# EAGLE board rpusb (EAGLE 9.6.2)
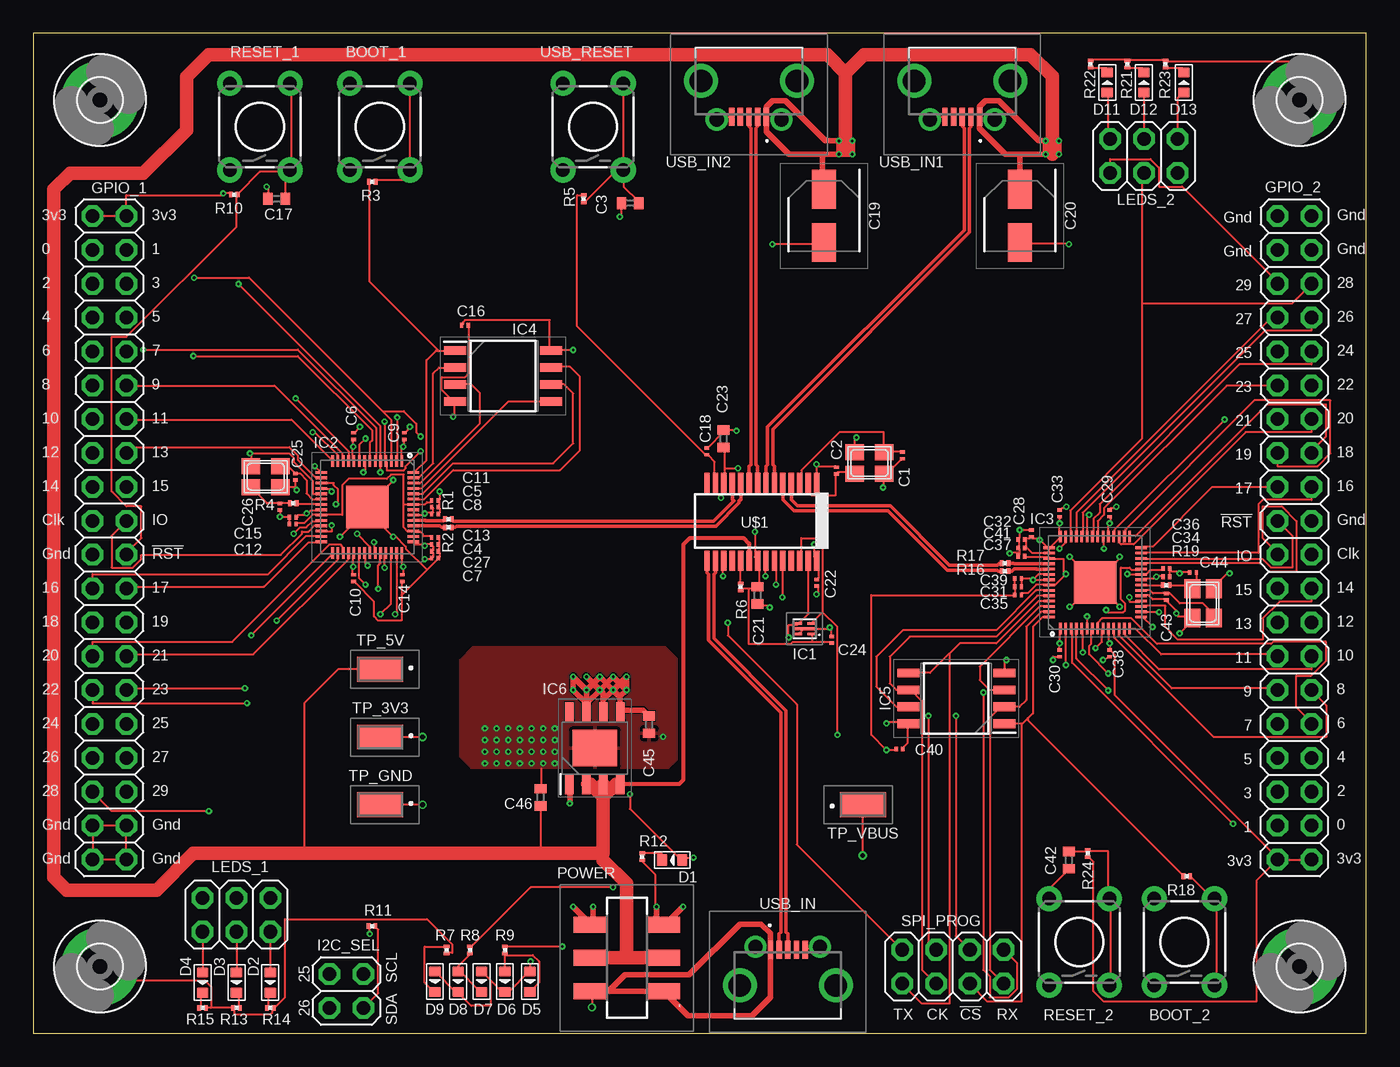
[diagram p4: board, top side]
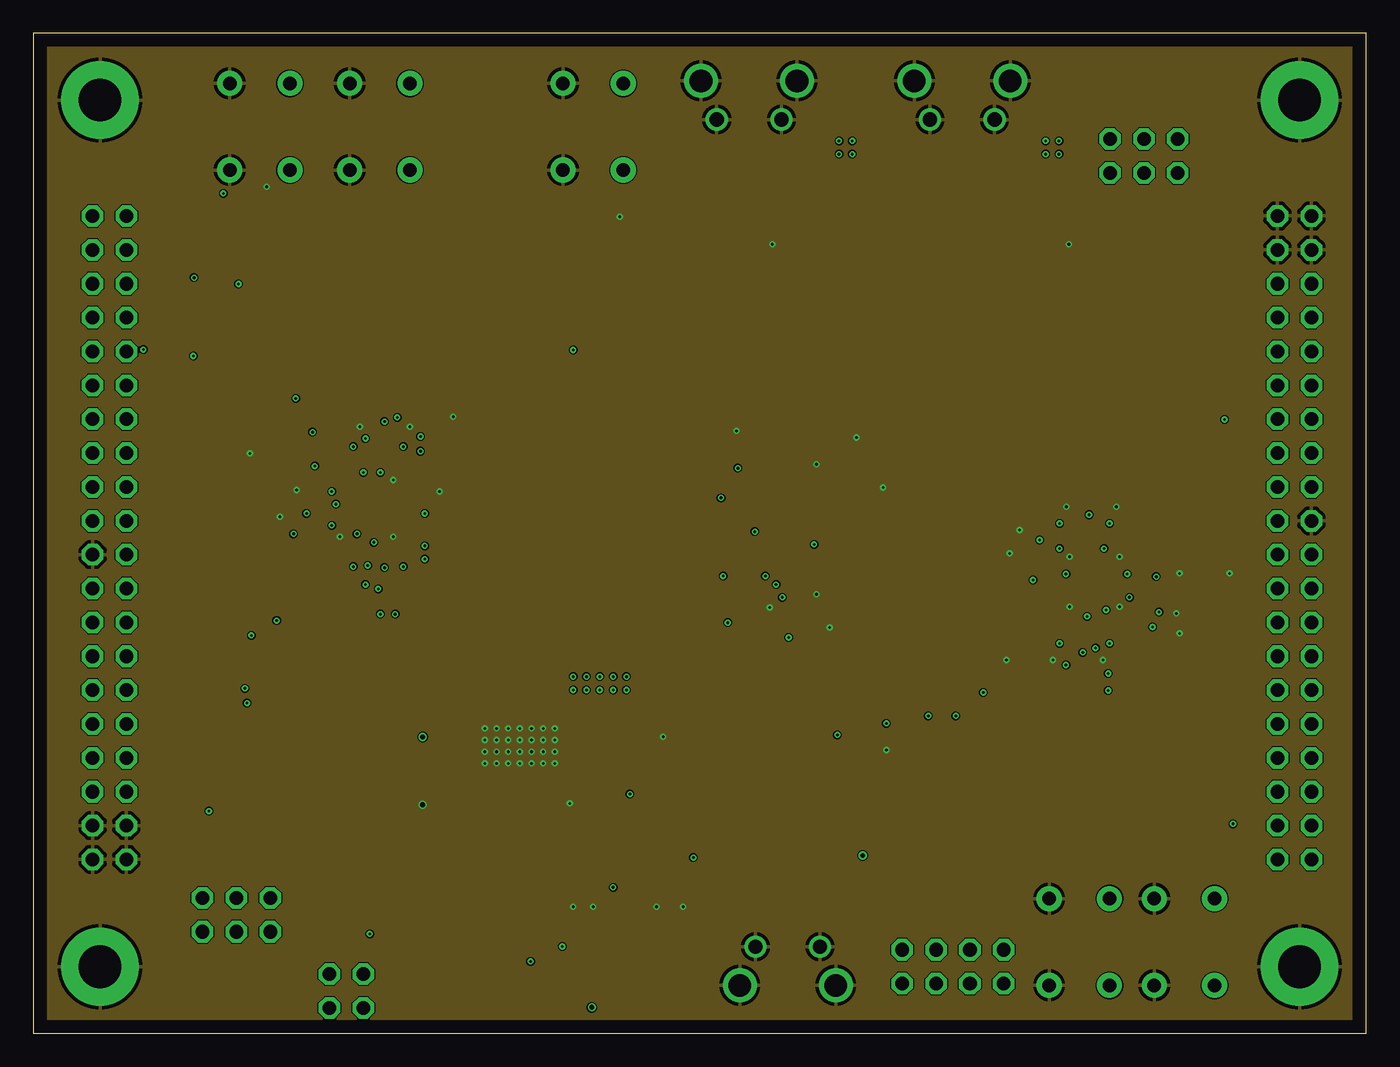
[diagram p5: board, inner layer Route2]
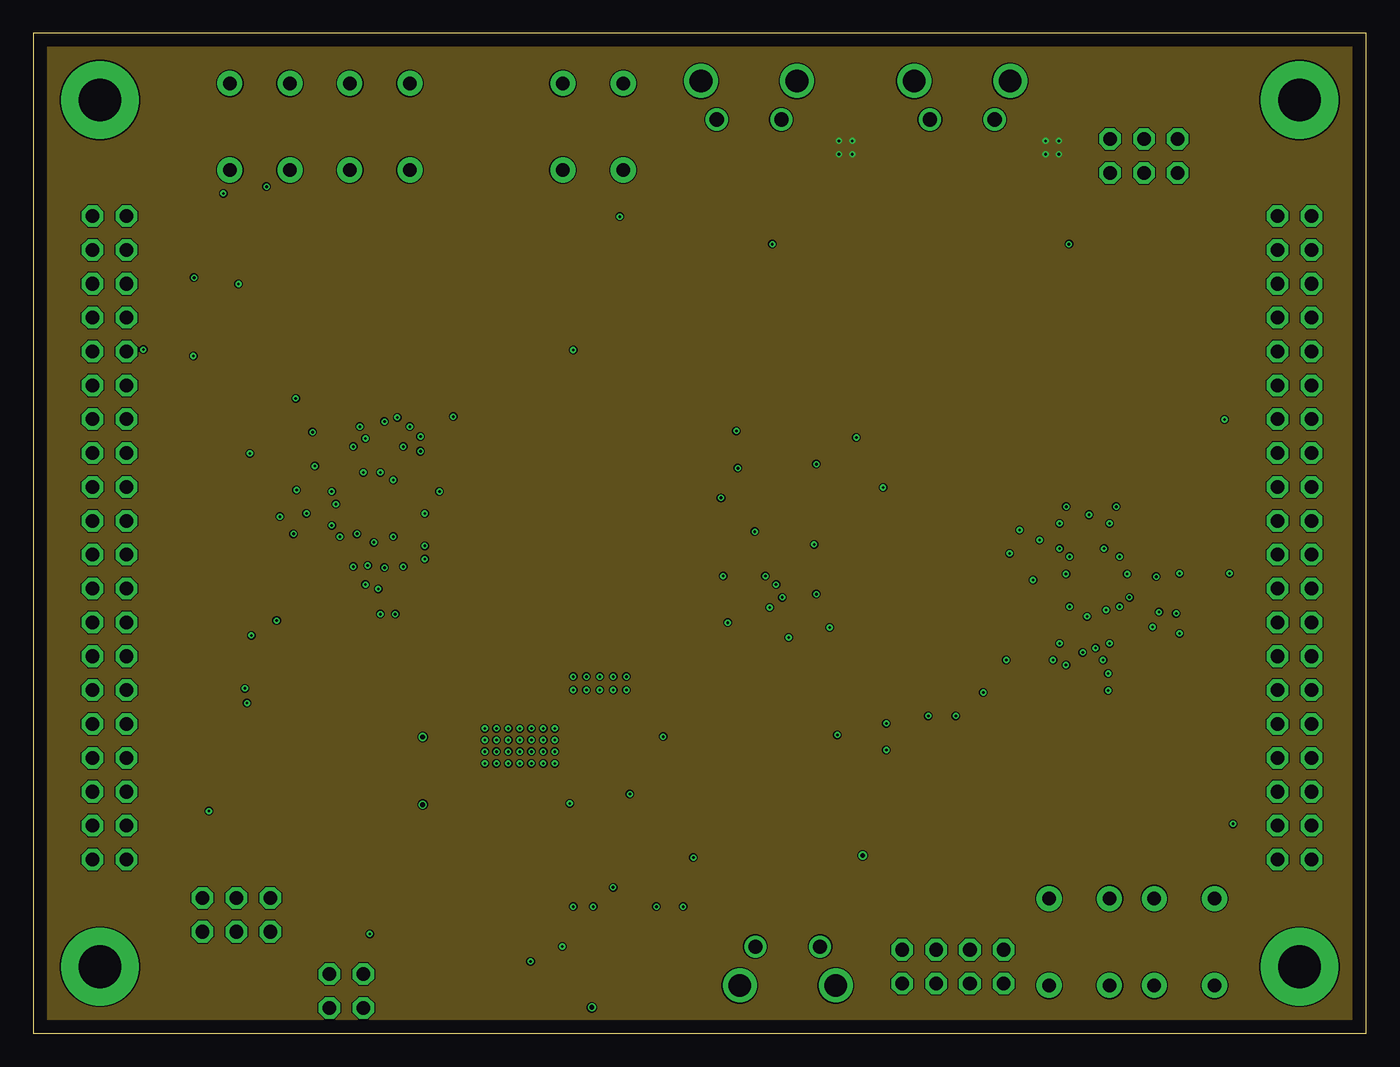
[diagram p6: board, inner layer Route15]
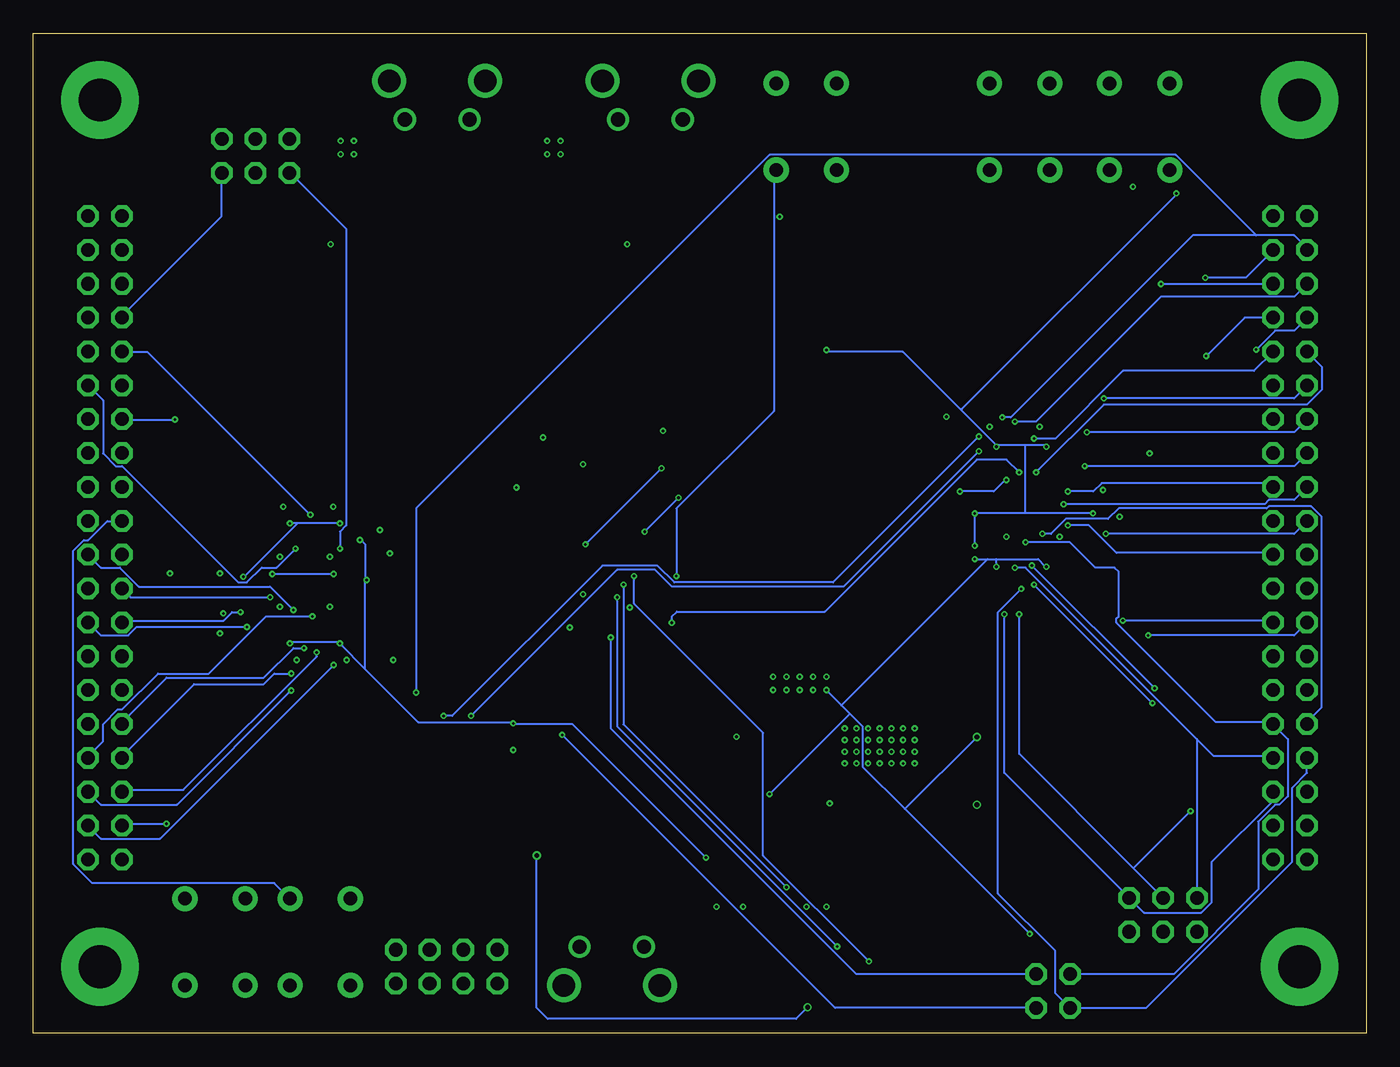
[diagram p7: board, bottom side, seen from below]

Size 100 x 75 mm. Coordinates in mm from the lower left corner, seen from the top.
Outline: 0,0 100,0 100,75 0,75 0,0
Copper layers (1+2*15+16): Top 0.0175mm / dielectric 0.195mm / Route2 0.0175mm / dielectric 1.065mm / Route15 0.0175mm / dielectric 0.195mm / Bottom 0.0175mm
Design rules "default *": minimum track width 3.5mil, minimum drill 0.2mm, track to track 3.5mil, track to pad 3.5mil, pad to pad 5mil, via to via 0.5mm, smd to smd 3.5mil, copper to edge 40mil, drill to drill 0.5mm, minimum pad ring 0.3mm, minimum via ring 0.13mm, stop-mask expansion 4mil, vias tented up to drill 0mil, thermal gap 10mil
Net classes: 0 default: width 0.152 mm; 1 USB: width 0.254 mm, clearance 0.127 mm to class 0, clearance 0.127 mm

## Footprints (pad centres in the part's own frame; a part is rotated, then mirrored left to right if it is on the bottom)
TACTILE-PTH = drill 1.016 pad 1.88: 1 -3.251,2.261; 2 3.251,2.261; 3 -3.251,-2.261; 4 3.251,-2.261
C0201 = smd 0.25 x 0.35: 1 -0.25,0; 2 0.25,0
C0402 = smd 0.7 x 0.9: 1 -0.65,0; 2 0.65,0
CAPAE530X550N = smd 2.9 x 1.8: 1 -2,0; 2 2,0
LED-0603 = smd 0.762 x 0.889: + -0.762,0; - 0.762,0
2X20 = drill 1.016 octagon: 1 -24.13,-1.27; 2 -24.13,1.27; 3 -21.59,-1.27; 4 -21.59,1.27; 5 -19.05,-1.27; 6 -19.05,1.27; 7 -16.51,-1.27; 8 -16.51,1.27; 9 -13.97,-1.27; 10 -13.97,1.27; 11 -11.43,-1.27; 12 -11.43,1.27; 13 -8.89,-1.27; 14 -8.89,1.27; 15 -6.35,-1.27; 16 -6.35,1.27; 17 -3.81,-1.27; 18 -3.81,1.27; 19 -1.27,-1.27; 20 -1.27,1.27; 21 1.27,-1.27; 22 1.27,1.27; 23 3.81,-1.27; 24 3.81,1.27; 25 6.35,-1.27; 26 6.35,1.27; 27 8.89,-1.27; 28 8.89,1.27; 29 11.43,-1.27; 30 11.43,1.27; 31 13.97,-1.27; 32 13.97,1.27; 33 16.51,-1.27; 34 16.51,1.27; 35 19.05,-1.27; 36 19.05,1.27; 37 21.59,-1.27; 38 21.59,1.27; 39 24.13,-1.27; 40 24.13,1.27
3,2-PAD = drill 3.2 pad 5.842: B3,2 0,0
2X02 = drill 1.016 octagon: 1 -1.27,-1.27; 2 -1.27,1.27; 3 1.27,-1.27; 4 1.27,1.27
M24C32FMH6TG = smd 0.6 x 0.2: 1 -0.5,0.4; 3 -0.5,-0.4; 4 0.5,-0.4; 5 0.5,0.4 | smd 1.6 x 0.2: 2 0,0
QFN40P700X700X90-57N = smd 0.85 x 0.2: 1 -3.45,2.6; 2 -3.45,2.2; 3 -3.45,1.8; 4 -3.45,1.4; 5 -3.45,1; 6 -3.45,0.6; 7 -3.45,0.2; 8 -3.45,-0.2; 9 -3.45,-0.6; 10 -3.45,-1; 11 -3.45,-1.4; 12 -3.45,-1.8; 13 -3.45,-2.2; 14 -3.45,-2.6; 29 3.45,-2.6; 30 3.45,-2.2; 31 3.45,-1.8; 32 3.45,-1.4; 33 3.45,-1; 34 3.45,-0.6; 35 3.45,-0.2; 36 3.45,0.2; 37 3.45,0.6; 38 3.45,1; 39 3.45,1.4; 40 3.45,1.8; 41 3.45,2.2; 42 3.45,2.6 | smd 0.2 x 0.85: 15 -2.6,-3.45; 16 -2.2,-3.45; 17 -1.8,-3.45; 18 -1.4,-3.45; 19 -1,-3.45; 20 -0.6,-3.45; 21 -0.2,-3.45; 22 0.2,-3.45; 23 0.6,-3.45; 24 1,-3.45; 25 1.4,-3.45; 26 1.8,-3.45; 27 2.2,-3.45; 28 2.6,-3.45; 43 2.6,3.45; 44 2.2,3.45; 45 1.8,3.45; 46 1.4,3.45; 47 1,3.45; 48 0.6,3.45; 49 0.2,3.45; 50 -0.2,3.45; 51 -0.6,3.45; 52 -1,3.45; 53 -1.4,3.45; 54 -1.8,3.45; 55 -2.2,3.45; 56 -2.6,3.45 | smd 3.2 x 3.2: 57 0,0
SOIC127P790X216-8N = smd 1.65 x 0.65: 1 -3.6,1.905; 2 -3.6,0.635; 3 -3.6,-0.635; 4 -3.6,-1.905; 5 3.6,-1.905; 6 3.6,-0.635; 7 3.6,0.635; 8 3.6,1.905
SOIC127P600X163-9N = smd 1.5 x 0.65: 1 -2.7,1.905; 2 -2.7,0.635; 3 -2.7,-0.635; 4 -2.7,-1.905; 5 2.7,-1.905; 6 2.7,-0.635; 7 2.7,0.635; 8 2.7,1.905 | smd 2.71 x 3.35: 9 0,0
2X03 = drill 1.016 octagon: 1 -2.54,-1.27; 2 -2.54,1.27; 3 0,-1.27; 4 0,1.27; 5 2.54,-1.27; 6 2.54,1.27
JS202011SCQN = smd 1.2 x 2.5: 1 -2.5,-2.75; 2 0,-2.75; 3 2.5,-2.75; 4 2.5,2.75; 5 0,2.75; 6 -2.5,2.75
NX3225 = smd 1.4 x 1.2: 1 -1.1,-0.8; 2 1.1,-0.8; 3 1.1,0.8; 4 -1.1,0.8
R0201 = smd 0.28 x 0.43: 1 -0.255,0; 2 0.255,0
2X04 = drill 1.016 octagon: 1 -3.81,-1.27; 2 -3.81,1.27; 3 -1.27,-1.27; 4 -1.27,1.27; 5 1.27,-1.27; 6 1.27,1.27; 7 3.81,-1.27; 8 3.81,1.27
S175146R = smd 3.45 x 1.85: 1 0,0
SSOP28-0.635 = smd 0.4 x 1.5: 1 -4.108,-2.844; 2 -3.476,-2.844; 3 -2.844,-2.844; 4 -2.212,-2.844; 5 -1.58,-2.844; 6 -0.948,-2.844; 7 -0.316,-2.844; 8 0.316,-2.844; 9 0.948,-2.844; 10 1.58,-2.844; 11 2.212,-2.844; 12 2.844,-2.844; 13 3.476,-2.844; 14 4.108,-2.844; 15 4.108,2.976; 16 3.476,2.976; 17 2.844,2.976; 18 2.212,2.976; 19 1.58,2.976; 20 0.948,2.976; 21 0.316,2.976; 22 -0.316,2.976; 23 -0.948,2.976; 24 -1.58,2.976; 25 -2.212,2.976; 26 -2.844,2.976; 27 -3.476,2.976; 28 -4.108,2.976
U254051T4BHJ25S2S = smd 0.4 x 1.35: 1 -1.3,0.675; 2 -0.65,0.675; 3 0,0.675; 4 0.65,0.675; 5 1.3,0.675 | drill 1.7 pad 2.3: MH1 -3.6,-2; MH2 3.6,-2 | drill 1.07 pad 1.4: MH3 2.425,0.9; MH4 -2.425,0.9

## Placement (x,y rotation side)
BOOT_1  B3F-1005  [TACTILE-PTH]  26,68 90 top
BOOT_2  B3F-1005  [TACTILE-PTH]  86.36,6.85 90 top
C1  15pF  [C0201]  65.21,43.35 270 top
C2  15pF  [C0201]  60.26,42.2 90 top
C3  10uF  [C0402]  44.78,62.27 180 top
C4  100nF  [C0201]  30.13,36.67 0 top
C5  100nF  [C0201]  30.13,39.46 0 top
C6  100nF  [C0201]  24.03,44.79 90 top
C7  100nF  [C0201]  30.13,35.65 0 top
C8  100nF  [C0201]  30.13,38.96 0 top
C9  100nF  [C0201]  27.84,44.79 90 top
C10  100nF  [C0201]  24.03,34.14 270 top
C11  100nF  [C0201]  30.13,39.97 0 top
C12  100nF  [C0201]  19.47,38.2 180 top
C13  1uF  [C0201]  30.13,37.18 0 top
C14  100nF  [C0201]  27.69,34.14 270 top
C15  100nF  [C0201]  19.47,38.71 180 top
C16  100nF  [C0201]  32.39,53.11 0 top
C17  10uF  [C0402]  18.26,62.59 180 top
C18  100nF  [C0201]  50.53,43.64 90 top
C19  100uF  [CAPAE530X550N]  59.32,61.31 270 top
C20  100uF  [CAPAE530X550N]  74.02,61.31 270 top
C21  4.7uF  [C0402]  54.34,32.84 270 top
C22  100nF  [C0201]  58.78,33.8 270 top
C23  4.7uF  [C0402]  51.8,44.59 90 top
C24  100nF  [C0201]  59.9,29.52 90 top
C25  15pF  [C0201]  19.65,41.75 270 top
C26  15pF  [C0201]  18.5,39.5 270 top
C27  1uF  [C0201]  30.13,36.16 0 top
C28  100nF  [C0201]  74.88,37.5 90 top
C29  100nF  [C0201]  80.75,39 90 top
C30  100nF  [C0201]  77,28.5 270 top
C31  100nF  [C0201]  73.88,33.5 180 top
C32  100nF  [C0201]  74.12,37.03 180 top
C33  100nF  [C0201]  77,39 90 top
C34  100nF  [C0201]  85,34.25 0 top
C35  100nF  [C0201]  73.88,32.88 180 top
C36  100nF  [C0201]  85,34.88 0 top
C37  1uF  [C0201]  74.12,35.78 180 top
C38  100nF  [C0201]  80.75,28.5 270 top
C39  100nF  [C0201]  73.88,34.12 180 top
C40  100nF  [C0201]  64.98,21.31 180 top
C41  1uF  [C0201]  74.12,36.4 180 top
C42  10uF  [C0402]  77.68,12.99 270 top
C43  15pF  [C0201]  85,32.75 270 top
C44  15pF  [C0201]  87.01,34.57 180 top
C45  10uF  [C0402]  46.2,23.16 270 top
C46  10uF  [C0402]  38.04,17.69 90 top
D1  GREEN  [LED-0603]  47.93,13 180 top
D2  GREEN  [LED-0603]  17.78,3.81 270 top
D3  GREEN  [LED-0603]  15.24,3.81 270 top
D4  GREEN  [LED-0603]  12.7,3.81 270 top
D5  GREEN  [LED-0603]  37.25,3.88 270 top
D6  GREEN  [LED-0603]  35.38,3.88 270 top
D7  GREEN  [LED-0603]  33.62,3.88 270 top
D8  GREEN  [LED-0603]  31.88,3.88 270 top
D9  GREEN  [LED-0603]  30.12,3.88 270 top
D11  GREEN  [LED-0603]  80.57,71.31 90 top
D12  GREEN  [LED-0603]  83.32,71.31 90 top
D13  GREEN  [LED-0603]  86.32,71.31 90 top
GPIO_1  [2X20]  5.71,37.17 270 top
GPIO_2  [2X20]  94.61,37.17 90 top
H1  MOUNT-PAD-ROUND3.2  [3,2-PAD]  95,5 0 top
H2  MOUNT-PAD-ROUND3.2  [3,2-PAD]  95,70 0 top
H3  MOUNT-PAD-ROUND3.2  [3,2-PAD]  5,70 0 top
H4  MOUNT-PAD-ROUND3.2  [3,2-PAD]  5,5 0 top
I2C_SEL  [2X02]  23.5,3.17 270 top
IC1  M24C02-FMH6TG  [M24C32FMH6TG]  57.87,30.34 180 top
IC2  RP2040  [QFN40P700X700X90-57N]  25.05,39.46 270 top
IC3  RP2040  [QFN40P700X700X90-57N]  79.65,33.82 90 top
IC4  16MB_Flash  [SOIC127P790X216-8N]  35.24,49.3 0 top
IC5  16MB_Flash  [SOIC127P790X216-8N]  69.24,25.12 180 top
IC6  AP7362-33SP-13  [SOIC127P600X163-9N]  42.12,21.4 90 top
LEDS_1  [2X03]  15.24,8.89 180 top
LEDS_2  [2X03]  83.32,65.81 0 top
POWER  JS202011SCQN  [JS202011SCQN]  44.53,5.66 90 top
Q1  12MHz  [NX3225]  17.43,41.75 180 top
Q2  12MHz  [NX3225]  62.73,42.78 180 top
Q3  12MHz  [NX3225]  87.75,32.25 90 top
R1  27R4  [R0201]  31.15,38.58 0 top
R2  27R4  [R0201]  31.15,37.94 0 top
R3  1K  [R0201]  25.43,63.86 180 top
R4  1K  [R0201]  19.5,39.75 0 top
R5  10K  [R0201]  41.29,62.59 90 top
R6  10K  [R0201]  53.07,33.48 270 top
R7  330R  [R0201]  31,6.25 90 top
R8  330R  [R0201]  32.75,6.25 90 top
R9  330R  [R0201]  35.38,6.25 90 top
R10  10K  [R0201]  15.08,62.91 180 top
R11  1K5  [R0201]  25.41,8.05 0 top
R12  1K  [R0201]  45.68,13.25 270 top
R13  1K  [R0201]  15.24,1.91 180 top
R14  1K  [R0201]  17.78,1.91 0 top
R15  1K  [R0201]  12.7,1.91 0 top
R16  27R4  [R0201]  72.9,34.67 180 top
R17  27R4  [R0201]  72.9,35.26 180 top
R18  1K  [R0201]  86.53,11.78 180 top
R19  1K  [R0201]  85,33.62 180 top
R21  1K  [R0201]  82.07,72.69 90 top
R22  1K  [R0201]  79.32,72.69 90 top
R23  1K  [R0201]  84.95,72.69 90 top
R24  10K  [R0201]  79.1,13.49 270 top
RESET_1  B3F-1005  [TACTILE-PTH]  17,68 90 top
RESET_2  B3F-1005  [TACTILE-PTH]  78.47,6.85 90 top
SPI_PROG  [2X04]  69,5 180 top
TP_3V3  S1751-46R  [S175146R]  26.04,22.23 0 top
TP_5V  S1751-46R  [S175146R]  26.04,27.3 0 top
TP_GND  S1751-46R  [S175146R]  26.04,17.14 0 top
TP_VBUS  S1751-46R  [S175146R]  62.23,17.14 180 top
U$1  SL2.2S  [SSOP28-0.635]  54.66,38.43 180 top
USB_IN  U254-051T-4BHJ25-S2S  [U254051T4BHJ25S2S]  56.6,5.6 0 top
USB_IN1  U254-051T-4BHJ25-S2S  [U254051T4BHJ25S2S]  69.7,69.44 180 top
USB_IN2  U254-051T-4BHJ25-S2S  [U254051T4BHJ25S2S]  53.7,69.44 180 top
USB_RESET  B3F-1005  [TACTILE-PTH]  42,68 90 top

## Tracks (layer width: path | path; a pad name or v marks a point on that pad's centre or on a via)
!QSPI2_SS!
  Top 0.152: IC3.56 75.72,31.22 75,30.5 75,24 74.63,23.63 | 74.14,23.22 74.22,23.22 74.63,23.63 | 74.14,23.22 73.88,23.22 IC5.1 | R18.2 86.2,11.91 74.61,23.5 74.61,23.65 74.63,23.63 | 74.14,23.22 74.14,2.38 71.6,2.38 70.33,3.65 SPI_PROG.4
!QSPI_SS!
  Top 0.152: IC2.56 28.56,42.06 29.5,43 29.5,50.5 30.2,51.2 30.32,51.2 | 30.32,51.2 IC4.1 | R3.2 25.24,63.82 25.24,56.36 30.32,51.28 30.32,51.2
!RESET_RP1!  (via drill 0.2)
  Top 0.152: 18.89,64.61 19.21,64.61 RESET_1.3 | 18.89,64.61 16.99,64.61 15.4,63.02 R10.1 15.24,62.87 15.24,60.48 6.99,52.23 5.87,52.23 5.87,40.64 6.99,39.53 8.1,39.53 8.1,37.15 6.99,36.04 GPIO_1.22 | 18.89,64.61 18.89,62.71 C17.1 | 18.89,64.61 RESET_1.3 | RESET_1.4 19.37,71.12 19.37,64.77 RESET_1.3 | v22.38,38.1 22.38,37.62 21.75,37.62 IC2.26
  Bottom 0.152: v22.38,38.1 20.8,38.1 18.73,36.04 6.99,36.04 GPIO_1.22
!RESET_RP2!
  Top 0.152: IC3.26 83.19,35.56 92.23,35.56 92.87,34.92 94.46,34.92 94.46,37.31 93.34,38.42 GPIO_2.22 | C42.1 77.79,13.65 79.06,13.65 R24.1 79.22,13.65 80.64,13.65 80.64,10.16 RESET_2.4 80.8,10 80.8,3.65 RESET_2.3
  Bottom 0.152: GPIO_2.22 93.34,38.42 94.46,38.42 95.89,36.99 96.2,36.99 97,36.2 97,12.7 95.57,11.27 81.92,11.27 80.8,10.16 RESET_2.4
!RESET_USB!  (via drill 0.2)
  Top 0.152: R5.1 41.43,62.39 43.66,64.61 44.13,64.61 USB_RESET.3 | C3.1 45.4,62.39 44.29,63.5 44.29,64.61 USB_RESET.3 | v51.75,34.29 51.75,35.4 U$1.17 | USB_RESET.4 44.29,71.12 44.29,64.77 USB_RESET.3
  Bottom 0.152: v51.75,34.29 51.75,39.37 44.45,46.67 44.45,64.45 44.29,64.61 USB_RESET.3
+1V8  (via drill 0.2)
  Top 0.152: C22.1 58.9,34.13 58.9,35.4 U$1.28 58.74,35.56 58.58,35.72 v58.58,36.67 | 51.91,42.39 51.91,41.43 U$1.12 | 51.91,42.39 51.91,43.81 C23.1 | 51.91,42.39 v52.86,42.39
  Bottom 0.152: v52.86,42.39 v58.58,36.67
+1V8_1
  Top 0.152: C12.1 19.84,38.26 20.32,38.26 20.95,38.89 21.59,38.89 IC2.23 21.75,38.89 23.18,38.89 23.18,41.12 23.65,41.59 26.51,41.59 26.83,41.91 27.78,41.91 27.78,39.69 | C11.1 29.84,39.85 29.53,39.85 29.37,39.69 28.57,39.69 IC2.50 28.42,39.69 27.78,39.69 | C13.1 29.84,37.31 29.21,37.31 29.21,37.47 29.05,37.62 28.57,37.62 IC2.45 28.42,37.62 28.1,37.62 27.78,37.94 27.78,39.69
+1V8_2  (via drill 0.2)
  Top 0.152: C37.1 74.45,35.72 76.2,35.72 IC3.45 76.2,35.56 77.31,35.56 77.31,34.29 | C36.1 84.77,34.77 83.82,34.77 83.5,34.45 83.19,34.45 IC3.23 83.03,34.45 v82.07,34.45 | 76.2,33.66 75.25,33.66 74.61,33.02 74.14,33.02 C35.1 | 77.31,34.29 76.68,33.66 76.2,33.66 | 76.2,33.66 IC3.50 | 77.31,34.29 v77.47,34.45
  Bottom 0.152: v77.47,34.45 v82.07,34.45
+3V3  (via drill 0.2)
  Top 0.152: 58.42,29.37 59.85,29.37 C24.1 | 58.42,29.37 58.42,29.84 IC1.1 | 53.66,33.34 54.29,33.34 C21.1 54.45,33.5 54.45,35.4 U$1.21 54.29,35.56 54.13,35.72 v54.13,37.62 | 53.66,33.34 53.18,33.34 R6.2 | 58.42,29.37 56.99,29.37 56.83,29.21 53.66,29.21 53.66,33.34 | R5.2 41.27,62.87 40.8,62.87 40.8,53.02 50.48,43.34 C18.1 50.64,43.34 51.12,42.86 51.12,41.43 U$1.13 51.28,41.27 51.28,40.48 v51.59,40.16
  Bottom 0.152: v51.59,40.16 v54.13,37.62
+3V3_RP  (via drill 0.2, 0.35)
  Top 0.152: 93.34,13.02 91.76,11.43 91.76,2.38 80.33,2.38 79.53,3.17 79.53,12.86 79.22,13.18 R24.2 | 93.34,13.02 95.89,13.02 GPIO_2.1 | 93.34,13.02 GPIO_2.2 93.34,13.18 81.12,25.4 81.12,28.42 80.8,28.73 | v75,34 74.93,34.13 74.14,34.13 C39.1 74.14,33.97 74.14,33.66 C31.1 | v75,34 75.09,33.97 76.2,33.97 IC3.49 IC3.48 75.42,34.42 v75,34 | C34.1 84.77,34.29 84.3,34.29 v84.25,34.25 84.14,34.13 83.19,34.13 83.19,33.97 IC3.22 | C29.1 80.8,38.73 80.8,38.26 v80.75,38.25 80.64,38.1 80.64,37.31 IC3.33 | C33.1 76.99,38.73 v76.99,38.26 v77,38.25 76.99,38.1 76.99,37.31 IC3.42 76.99,37.15 76.2,36.35 | 74.45,36.51 74.45,36.99 C32.1 74.45,37.15 74.77,37.15 C28.1 74.93,37.15 75.41,37.15 v75.5,37 75.56,36.99 76.2,36.35 | 74.45,36.51 C41.1 | 76.2,36.35 IC3.44 74.95,36.02 74.45,36.51 | 76.2,36.35 IC3.43 | v64,23.25 64.14,23.34 65.56,23.34 IC5.8 65.56,23.18 65.56,21.75 65.25,21.43 C40.1 | C30.1 76.99,28.73 76.99,29.21 v77,29.25 76.99,29.37 76.99,30.32 IC3.1 | 80.8,28.73 80.8,29.21 v80.75,29.25 80.64,29.37 80.64,30.32 IC3.10 | 80.8,28.73 C38.1 | v25.24,7.46 25.24,7.94 R11.1 | v44.77,17.94 44.77,16.83 48.58,13.02 D1.+ 48.74,13.02 48.74,13.18 v49.53,13.18 | R10.2 14.76,63.02 14.29,63.02 v14.25,63 14.13,62.87 6.99,62.87 GPIO_1.2 6.99,61.28 4.45,61.28 GPIO_1.1 | v40.5,51.25 40.48,51.28 38.89,51.28 IC4.8 38.73,51.28 38.73,53.5 32.38,53.5 32.23,53.34 32.23,53.18 C16.1 | C6.1 23.97,44.45 23.97,44.13 v24,44 23.97,43.97 23.97,43.02 IC2.10 | C9.1 27.78,44.45 27.78,44.13 v27.75,44 27.62,43.97 27.62,43.02 IC2.1 | C15.1 19.84,38.73 19.84,38.89 20.48,38.89 v20.5,39 20.64,39.05 20.8,39.21 21.59,39.21 IC2.22
  Top 0.152: C5.1 30,39.37 30,39.05 C8.1 29.84,39.05 29.37,39.05 v29.37,38.99 29.21,38.89 28.57,38.89 | 28.57,38.89 28.57,39.21 IC2.49 | 28.57,38.89 IC2.48 | C14.1 27.78,34.45 27.78,34.92 v27.75,35 27.62,35.08 27.62,35.88 IC2.42 | C10.1 23.97,34.45 23.97,34.92 v24,35 23.97,35.08 23.97,35.88 IC2.33 | v29.36,35.56 v29.37,35.56 29.84,35.56 C7.1 30,35.72 30,36.04 C27.1 30,36.2 30,36.51 C4.1 29.84,36.67 29.37,36.67 v29.36,36.56 29.21,36.67 28.57,36.67 28.57,36.83 | 28.57,36.83 28.57,37.31 IC2.44 | 28.57,36.83 IC2.43 | v29.21,22.23 TP_3V3.1
  Top 0.406: 41.49,24.76 IC6.7 41.49,24.74 v42.5,25.75 | 41.49,24.76 v41.49,25.74 v41.5,25.75 | 41.49,24.76 v40.5,25.75 v40.5,26.75 v41.5,25.75 | v42.5,25.75 42.76,25.49 IC6.6 42.76,25.01 v43.5,25.75 | 44.03,24.25 44.03,25.22 | 44.03,25.22 v43.5,25.75 | IC6.5 44.03,24.25 | 44.03,25.22 44.03,25.28 v44.5,25.75 | v43.5,25.75 v42.5,26.75 v41.5,25.75 | v42.5,25.75 v43.5,26.75 v44.5,25.75 | v43.5,25.75 v44.5,26.75 v44.5,25.75 | v42.5,25.75 v41.5,26.75 | C45.1 45.76,24.25 44.03,24.25
  Bottom 0.152: 80.17,38.26 77.15,38.26 v77,38.25 | 80.17,38.26 80.64,38.26 v80.75,38.25 | 80.17,38.26 84.14,34.29 v84.25,34.25 | v75.5,37 75.41,36.99 75.09,36.67 75.09,34.13 v75,34 75.09,33.97 75.09,27.3 | v80.75,29.25 80.64,29.37 77.15,29.37 v77,29.25 76.99,29.21 75.09,27.3 | 75.09,27.3 71.12,23.34 64.14,23.34 v64,23.25 63.98,23.18 59.53,23.18 v49.53,13.18 | 34.61,16.83 37.78,20 37.78,23.02 38.73,23.97 | 34.61,16.83 v25.24,7.46 | 39.37,24.61 40.48,25.72 v40.5,25.75 | 39.37,24.61 38.73,23.97 | 38.73,23.97 v44.77,17.94 | 25.56,44.13 27.62,44.13 v27.75,44 27.78,44.13 30.48,46.83 | 25.56,44.13 24.13,44.13 v24,44 | 28.42,35.56 29.21,35.56 v29.36,35.56 | 28.42,35.56 27.78,35.56 | 27.78,35.56 24.61,35.56 24.13,35.08 v24,35 | 27.78,35.56 27.78,35.08 v27.75,35 | v29.36,36.56 29.37,36.67 29.37,38.89 v29.37,38.99 29.21,39.05 25.56,39.05 | 25.56,39.05 20.64,39.05 v20.5,39 | 25.56,39.05 25.56,44.13 | 30.48,46.83 34.77,51.12 40.48,51.12 v40.5,51.25 | 30.48,46.83 30.32,46.83 14.29,62.87 v14.25,63 | 28.42,35.56 39.37,24.61 | 34.61,16.83 v29.21,22.23
+5V  (via drill 0.2)
  Top 0.152: 38.1,13.5 38.1,16.99 C46.1 | TP_5V.1 22.86,27.3 20.32,24.77 20.32,13.5
  Top 0.305: U$1.20 53.71,36.73 53.32,37.12 49.24,37.12 48.75,36.63 48.75,19 48.45,18.7 IC6.4
  Top 0.406: 59.2,65.94 56.7,65.94 55,67.64 USB_IN2.1 55,69.49 55.45,69.94 56.45,69.94 59.45,66.94 v60.45,66.94 | 59.2,65.94 v60.45,65.94 | v60.45,65.94 v61.45,65.94 v61.45,66.94 60.95,66.94 | v60.45,66.94 v60.45,65.94 | C19.1 59.2,63.43 59.2,65.94 | v60.45,66.94 60.95,66.44 | 73.95,65.94 72.95,65.94 71,67.89 USB_IN1.1 71,69.49 71.45,69.94 72.45,69.94 75.45,66.94 v75.95,66.94 | 73.95,65.94 v75.95,65.94 | v75.95,65.94 76.45,65.94 v76.95,65.94 v76.95,66.94 v75.95,66.94 | v75.95,66.94 v75.95,65.94 | C20.1 74.02,65.86 73.95,65.94 | IC6.2 | 41.5,6 41.78,5.72 | 41.78,5.72 POWER.5 | 41.72,5.72 41.78,5.72 | 41.5,5.45 41.78,5.72 | 47.41,5.66 POWER.2
  Top 0.813: 42.75,13 42.75,13.5 | 42.75,17.75 IC6.3 | IC6.2 41.8,18.7 | IC6.4 43.7,18.7 | 60.95,66.94 60.95,66.44
  Top 1.016: POWER.5 44.5,5.66 | 44.5,5.66 POWER.2 | 42.75,13 44.5,11.25 44.5,5.66 | 42.75,17.75 42.75,13.5 38.1,13.5 20.32,13.5 12,13.5 9.25,10.75 2.5,10.75 1.55,11.7 1.55,63.3 2.75,64.5 8.25,64.5 11.5,67.75 11.5,71.75 13.14,73.39 59.57,73.39 60.95,72.01 | IC6.3 | 41.8,18.7 42.75,17.75 | 43.7,18.7 42.75,17.75 | 60.95,72.01 60.95,66.94 | 60.95,72.01 62.32,73.39 74.82,73.39 76.45,71.76 76.45,65.94
  pour Route15: -6,82 106,82 106,-6 -6,-6
GND  (via drill 0.2, 0.35)
  Top 0.152: 13.34,1.91 R13.2 15.08,1.91 15.08,1.43 17.78,1.43 17.94,1.59 17.94,1.91 R14.2 18.1,1.91 18.89,2.7 18.89,8.57 29.53,8.57 31.43,6.67 31.43,6.03 31.11,6.03 R7.1 | 13.34,1.91 R15.2 | C13.2 30.48,37.15 30.48,36.67 C4.2 30.48,36.51 30.48,36.2 C27.2 30.48,36.04 30.48,35.72 C7.2 30.32,35.56 29.53,34.77 | 27.62,32.86 27.62,33.81 C14.2 | 27.62,32.86 27.62,30.96 25.88,30.96 25.56,31.27 25.56,32.38 24.13,33.81 C10.2 | 27.62,32.86 29.53,34.77 | 31.59,47.31 30.64,48.26 30.64,49.21 32.38,49.21 32.7,49.53 32.7,53.02 C16.2 | R22.2 79.38,73.03 81.92,73.03 R21.2 82.07,73.03 84.93,73.03 R23.2 85.09,72.87 94.93,72.87 94.93,70.01 H2.B3,2 | C1.2 65.09,43.02 63.98,41.91 Q2.4 63.82,41.91 63.82,40.96 v63.75,40.94 | IC1.5 57.47,30 57.78,30.32 IC1.2 57.94,30.32 59.69,30.32 v59.75,30.44 59.85,30.32 59.85,29.84 C24.2 | C18.2 50.64,43.97 51.75,45.09 C23.2 51.91,45.24 52.7,45.24 v52.75,45.19 | 73.98,36.07 73.98,36.35 C41.2 73.98,36.51 73.98,36.99 C32.2 73.98,37.15 73.98,37.62 v74,37.75 74.14,37.78 74.77,37.78 C28.2 | 73.98,36.07 73.98,35.88 C37.2 | C39.2 73.66,33.97 73.66,33.66 C31.2 73.66,33.5 73.66,33.02 C35.2 73.5,32.86 62.87,32.86 62.87,22.38 63.98,21.27 v64,21.25 64.14,21.27 64.61,21.27 C40.2 | C8.2 30.48,39.05 30.48,39.37 C5.2 30.48,39.53 30.48,39.85 C11.2 30.48,40.01 v30.48,40.64 | 85.25,34.61 85.25,34.77 C36.2 | 85.25,34.61 85.25,34.29 C34.2 | C12.2 19.21,38.26 19.21,38.58 C15.2 19.21,38.73 18.57,38.73 v18.5,38.75 18.57,38.89 18.57,39.21 C26.2 | 19.68,40.96 19.68,40.8 v19.75,40.75 19.68,40.96 | 19.68,40.96 19.68,41.43 C25.2 | C6.2 24.13,45.09 24.45,45.4 v24.5,45.5
  Top 0.152: C9.2 27.94,45.09 28.1,45.24 28.1,45.4 v28.25,45.5 | C22.2 58.9,33.5 58.9,33.02 v58.75,32.94 | C2.2 60.17,42.55 58.9,42.55 v58.75,42.69 58.74,42.55 58.74,41.43 U$1.1 | C30.2 76.52,28.26 76.52,28.1 v76.5,28 | C38.2 80.64,28.26 80.33,27.94 v80.25,28 | C33.2 77.15,39.37 77.47,39.37 v77.5,39.5 | C29.2 80.8,39.37 81.12,39.37 v81.25,39.5 | C44.2 86.68,34.61 86.04,34.61 v86,34.5 85.88,34.61 85.25,34.61 | R12.2 45.72,12.86 46.67,11.91 46.67,9.68 v46.75,9.5 | IC3.19 83.19,32.86 83.66,32.86 83.98,32.54 84.93,32.54 C43.2 85.09,32.38 85.72,31.75 85.72,31.59 v85.75,31.5 85.88,31.43 85.88,31.27 86.84,31.27 Q3.4 86.95,30.95 v86,30 | 16.35,43.5 19.21,43.5 19.53,43.18 19.53,42.86 20.95,41.43 20.95,40.48 21.59,40.48 IC2.19 | 38.1,19.88 38.1,18.41 C46.2 | C17.2 17.62,62.71 17.62,63.5 v17.5,63.5 | C21.2 54.45,32.07 55.24,32.07 v55.25,31.94 | C42.2 77.63,12.22 76.36,10.95 76.36,10.16 RESET_2.2 | C3.2 44.13,61.28 v44,61.25 | USB_IN2.5 52.39,68.74 51.28,68.74 51.28,68.58 USB_IN2.MH3 | USB_IN.5 57.94,6.35 58.9,6.35 USB_IN.MH3 | USB_IN1.5 68.26,68.74 67.31,68.74 67.31,68.58 USB_IN1.MH3 | 19.68,40.96 18.57,40.96 Q1.4 | 16.35,43.5 16.35,42.7 Q1.2 | 16.35,43.5 v16.25,43.5 | Q2.2 61.59,43.66 61.59,44.61 v61.75,44.69 | Q3.2 88.58,33.5 89.69,34.61 v89.75,34.5 | IC5.4 72.87,27.15 72.87,27.94 v73,28 | C19.2 59.21,59.21 55.56,59.21 v55.45,59.19 | C20.2 74.14,59.21 77.63,59.21 v77.7,59.19 | 25.08,39.53 26.99,41.43 v27,41.5 | 25.08,39.53 IC2.57 25.05,39.3 v23,37.25 | 79.69,33.81 81.44,32.07 v81.5,32 | 79.69,33.81 IC3.57 77.83,32 v77.75,32 | 31.59,47.31 31.59,46.35 v31.5,46.25 | 31.59,47.31 IC4.4 | 29.53,34.77 27.94,36.35 27.94,36.51 27.15,37.31 v27,37.25 25.08,39.17 25.08,39.53
  Top 0.152: 13.34,1.91 13.34,3.49 12.86,3.97 5.08,3.97 5.08,4.92 H4.B3,2 | v73.25,36 73.32,36.07 73.98,36.07 | v77.75,35.75 79.69,33.81 | 79.69,33.81 | v81.5,35.75 81.5,35.63 79.69,33.81 | v29.21,17.14 TP_GND.1 | GPIO_1.40 GPIO_1.38 GPIO_1.37 GPIO_1.39 GPIO_1.40
  Top 0.406: IC6.1 40.25,18.67 v40.25,17.25 | v42,9.5 42,8.38 POWER.4 41.78,8.22 v40.5,9.5 | v46.75,9.5 46.75,8.75 46.5,8.5 46.84,8.15 POWER.3 47.41,8.15 v48.75,9.5
  Bottom 0.152: v30.48,40.64 27.94,40.64 27.15,41.43 v27,41.5
  other vias: 36.5,20.25 47.25,22.25 35.62,20.25 34.75,20.25 33.88,20.25 33.88,21.12 34.75,21.12 35.62,21.12 36.5,21.12 36.5,22 35.62,22 34.75,22 33.88,22 37.38,22 38.25,22 39.12,22 39.12,22.88 38.25,22.88 37.38,22.88 36.5,22.88 35.62,22.88 34.75,22.88 33.88,22.88 39.12,21.12 39.12,20.25 37.38,21.12 38.25,21.12 38.25,20.25 37.38,20.25
  pour Route2: -2,78 -2,-2 102,-2 102,78
  pour Top: 33,29 47.38,29 48.25,28.13 48.25,20.5 47.62,19.88 32.88,19.88 32,20.75 32,28
GPIO0  (via drill 0.2)
  Top 0.152: v27.3,46.2 27.3,43.02 IC2.2 | v71.28,25.56 71.28,4.76 71.75,4.29 71.75,2.7 73.18,2.7 73.82,3.33 73.82,5.24 72.87,6.19 SPI_PROG.1
  Bottom 0.152: v27.3,46.2 26.67,46.2 13.02,59.85 8.26,59.85 | 8.26,59.85 5.4,59.85 4.45,58.9 GPIO_1.3 | v71.28,25.56 71.28,39.37 44.77,65.88 14.29,65.88 8.26,59.85
GPIO1  (via drill 0.2)
  Top 0.152: 26.19,46.67 16.19,56.67 v12.06,56.67 | 26.19,46.67 26.83,46.04 26.83,43.02 IC2.3 | v69.22,23.81 69.22,7.3 70.17,6.35 SPI_PROG.3 | v29.05,44.77 28.73,45.09 28.73,45.72 27.78,46.67 26.19,46.67
  Bottom 0.152: v12.06,56.67 9.05,56.67 6.99,58.74 GPIO_1.4 | v69.22,23.81 68.58,23.81 57.31,35.08 53.18,35.08 51.91,33.81 40.01,33.81 v29.05,44.77
GPIO2  (via drill 0.2)
  Top 0.152: v26.35,45.88 26.35,43.02 IC2.4 26.51,42.86 26.51,42.23 27.78,42.23 27.94,42.39 27.94,42.55 v29.05,43.66 | v67.15,23.81 67.15,6.83 67.63,6.35 SPI_PROG.5
  Bottom 0.152: v26.35,45.88 24.77,45.88 15.4,55.24 5.4,55.24 4.45,56.2 GPIO_1.5 | v67.15,23.81 56.2,34.77 53.34,34.77 52.07,33.5 39.21,33.5 v29.05,43.66
GPIO2_0  (via drill 0.2)
  Top 0.152: v77.47,27.62 77.47,30.32 IC3.2
  Bottom 0.152: v77.47,27.62 90.49,14.61 94.93,14.61 95.89,15.56 GPIO_2.3
GPIO2_1  (via drill 0.2)
  Top 0.152: v90.01,15.72 77.95,27.78 77.95,30.32 IC3.3
  Bottom 0.152: v90.01,15.72 93.34,15.72 GPIO_2.4
GPIO2_2  (via drill 0.2)
  Top 0.152: v80.64,25.72 78.26,28.1 78.26,30.32 IC3.4
  Bottom 0.152: v80.64,25.72 89.22,17.14 94.93,17.14 95.89,18.1 GPIO_2.5
GPIO2_3  (via drill 0.2)
  Top 0.152: v78.74,28.57 78.74,30.32 IC3.5
  Bottom 0.152: v78.74,28.57 78.74,28.26 88.74,18.26 93.34,18.26 GPIO_2.6
GPIO2_4  (via drill 0.2)
  Top 0.152: v79.06,31.27 79.06,30.48 IC3.6
  Bottom 0.152: v79.06,31.27 82.55,31.27 86.84,26.99 90.65,26.99 93.34,24.29 93.66,24.29 94.77,23.18 94.77,21.91 95.89,20.8 GPIO_2.7
GPIO2_5  (via drill 0.2)
  Top 0.152: v80.64,26.99 79.22,28.42 79.22,29.05 79.38,29.21 79.38,30.32 IC3.7
  Bottom 0.152: v80.64,26.99 81.92,26.99 82.71,26.19 87.95,26.19 93.34,20.8 GPIO_2.8
GPIO2_6
  Top 0.152: IC3.8 79.85,30.48 79.85,30.8 80.17,31.11 82.39,31.11 84.3,29.21 92.87,29.21 93.03,29.37 97,29.37 97,27.94 95.89,26.83 94.77,26.83 94.77,24.45 95.89,23.34 GPIO_2.9
GPIO2_7  (via drill 0.2)
  Top 0.152: v79.69,28.89 80.17,29.37 80.17,30.32 IC3.9
  Bottom 0.152: v79.69,28.89 80.49,28.89 82.71,26.67 90.01,26.67 93.34,23.34 GPIO_2.10
GPIO2_8
  Top 0.152: IC3.11 81.12,30.32 81.12,29.69 88.58,22.23 97,22.23 97,24.61 95.89,25.72 GPIO_2.11
GPIO2_9
  Top 0.152: IC3.12 81.44,30.32 81.44,29.84 85.41,25.88 93.34,25.88 GPIO_2.12
GPIO2_10
  Top 0.152: GPIO_2.13 95.89,27.3 84.45,27.3 81.92,29.84 81.92,30.32 IC3.13
GPIO2_11
  Top 0.152: IC3.14 82.23,30.32 82.71,30.32 84.61,28.42 93.34,28.42 GPIO_2.14
GPIO2_12  (via drill 0.2)
  Top 0.152: v83.98,30.48 83.19,31.27 IC3.15
  Bottom 0.152: v83.98,30.48 92.23,30.48 92.87,29.84 94.93,29.84 95.89,30.8 GPIO_2.15
GPIO2_13  (via drill 0.2)
  Top 0.152: v84.45,31.59 83.19,31.59 IC3.16
  Bottom 0.152: v84.45,31.59 85.09,31.59 85.72,30.96 93.34,30.96 GPIO_2.16
GPIO2_14
  Top 0.152: GPIO_2.17 95.89,32.38 93.5,32.38 92.23,31.11 92.23,29.53 85.88,29.53 84.93,30.48 84.93,32.07 83.19,32.07 IC3.17
GPIO2_15  (via drill 0.2)
  Top 0.152: v82.23,32.7 82.23,32.38 83.03,32.38 IC3.18
  Bottom 0.152: v82.23,32.7 92.71,32.7 93.34,33.34 GPIO_2.18
GPIO2_16
  Top 0.152: GPIO_2.23 95.89,40.01 92.23,40.01 91.92,39.69 91.92,36.04 83.19,36.04 IC3.27
GPIO2_17
  Top 0.152: IC3.28 83.19,36.51 83.98,36.51 88.42,40.96 93.34,40.96 GPIO_2.24
GPIO2_18
  Top 0.152: IC3.29 82.23,37.31 82.71,37.31 92.55,47.15 97,47.15 97,44.77 95.89,43.66 GPIO_2.25
GPIO2_19
  Top 0.152: GPIO_2.26 93.34,42.55 96.36,42.55 97.31,43.5 97.31,47.47 91.6,47.47 81.92,37.78 81.92,37.31 IC3.30
GPIO2_20
  Top 0.152: GPIO_2.27 95.89,45.09 90.96,45.09 82.55,36.67 81.6,36.67 81.44,36.83 81.44,37.15 IC3.31
GPIO2_21  (via drill 0.2)
  Top 0.152: v89.38,46.04 81.12,37.78 81.12,37.31 IC3.32
  Bottom 0.152: v89.38,46.04 93.34,46.04 GPIO_2.28
GPIO2_22  (via drill 0.2)
  Top 0.152: v80.33,36.35 80.33,37.15 IC3.34
  Bottom 0.152: v80.33,36.35 81.76,34.92 82.87,34.92 83.98,33.81 84.61,33.81 93.34,42.55 93.82,42.55 94.77,43.5 94.77,47.47 95.89,48.58 GPIO_2.29
GPIO2_23
  Top 0.152: IC3.35 79.85,37.31 79.85,38.42 80.33,38.89 80.33,39.37 89.53,48.58 93.34,48.58 GPIO_2.30
GPIO2_24
  Top 0.152: GPIO_2.31 95.89,50.16 90.49,50.16 80.01,39.69 80.01,39.05 79.53,38.58 79.53,37.31 IC3.36
GPIO2_25  (via drill 0.2)
  Top 0.152: v79.22,38.89 79.06,38.73 79.06,37.31 IC3.37
  Bottom 0.152: v79.22,38.89 91.44,51.12 93.34,51.12 GPIO_2.32
GPIO2_26
  Top 0.152: GPIO_2.33 95.89,52.7 92.39,52.7 78.74,39.05 78.74,37.31 IC3.38
GPIO2_27
  Top 0.152: IC3.39 78.26,37.31 78.26,39.05 92.87,53.66 93.34,53.66 GPIO_2.34
  Bottom 0.152: LEDS_2.5 85.88,64.45 85.88,61.28 93.34,53.82 GPIO_2.34
GPIO2_28
  Top 0.152: 83.19,54.77 83.19,64.45 LEDS_2.3 | 83.19,54.77 83.19,44.61 77.79,39.21 77.79,37.31 IC3.40 | 83.19,54.77 94.46,54.77 95.89,56.2 GPIO_2.35
GPIO2_29  (via drill 0.2)
  Top 0.152: v76.99,36.35 77.47,36.83 77.47,37.15 IC3.41 | GPIO_2.36 93.34,56.36 86.2,63.5 84.45,63.5 84.45,64.93 83.82,65.56 80.8,65.56 80.8,64.61 LEDS_2.1
  Bottom 0.152: v76.99,36.35 76.99,37.62 76.52,38.1 76.52,60.33 80.64,64.45 LEDS_2.1
GPIO3  (via drill 0.2)
  Top 0.152: v15.4,56.2 26.04,45.56 26.04,43.02 IC2.5 26.04,42.86 v26.04,42.07 | v52.1,30.8 52.1,29.84 57.28,24.67 57.28,14.16 65.09,6.35 SPI_PROG.7
  Bottom 0.152: v15.4,56.2 6.99,56.2 GPIO_1.6 | v52.1,30.8 52.1,31.24 51.72,31.62 40.61,31.62 29.21,43.02 26.99,43.02 v26.04,42.07
GPIO4  (via drill 0.2)
  Top 0.152: v8.26,51.28 19.84,51.28 25.72,45.4 25.72,43.02 IC2.6
  Bottom 0.152: v8.26,51.28 6.83,52.7 5.4,52.7 4.45,53.66 GPIO_1.7
GPIO5  (via drill 0.2)
  Top 0.152: v12,50.8 19.84,50.8 25.4,45.24 25.4,44.45 25.24,44.29 25.24,43.02 IC2.7
  Bottom 0.152: v12,50.8 9.12,53.68 GPIO_1.8
GPIO6  (via drill 0.2)
  Top 0.152: IC2.8 24.89,42.87 24.89,42.2 v24.77,42.07
  Bottom 0.152: v24.77,42.07 19.68,47.15 4.45,47.15 3.33,48.26 3.33,50.01 4.45,51.12 GPIO_1.9
GPIO7  (via drill 0.2)
  Top 0.152: v24.92,44.61 24.45,44.13 24.45,43.02 IC2.9
  Bottom 0.152: v24.92,44.61 23.34,44.61 18.26,49.69 8.41,49.69 6.99,51.12 GPIO_1.10
GPIO8  (via drill 0.2)
  Top 0.152: v19.68,47.62 23.65,43.66 23.65,43.02 IC2.11
  Bottom 0.152: v19.68,47.62 5.4,47.62 4.45,48.58 GPIO_1.11
GPIO9
  Top 0.152: IC2.12 23.18,43.02 23.18,43.5 18.1,48.58 6.99,48.58 GPIO_1.12
GPIO10  (via drill 0.2)
  Top 0.152: v20.95,45.09 21.11,45.09 22.86,43.34 22.86,43.02 IC2.13
  Bottom 0.152: v20.95,45.09 5.4,45.09 4.45,46.04 GPIO_1.13
GPIO11
  Top 0.152: IC2.14 22.38,43.02 19.37,46.04 6.99,46.04 GPIO_1.14
GPIO12  (via drill 0.2)
  Top 0.152: v21.11,42.55 IC2.15
  Bottom 0.152: v21.11,42.55 5.4,42.55 4.45,43.5 GPIO_1.15
GPIO13
  Top 0.152: GPIO_1.16 6.99,43.97 19.21,43.97 19.84,43.34 19.84,43.02 21.11,41.75 21.59,41.75 IC2.16
GPIO14  (via drill 0.2)
  Top 0.152: v22.7,39.69 22.86,39.85 22.86,40.8 22.54,41.12 22.54,41.27 21.75,41.27 IC2.17
  Bottom 0.152: v22.7,39.69 7.62,39.69 7.3,40.01 5.4,40.01 4.45,40.96 GPIO_1.17
GPIO15  (via drill 0.2)
  Top 0.152: v22.38,40.64 22.38,40.8 21.75,40.8 IC2.18
  Bottom 0.152: v22.38,40.64 20.48,40.64 19.84,41.27 7.14,41.27 6.99,41.12 GPIO_1.18
GPIO16
  Top 0.152: GPIO_1.23 4.45,34.45 17.62,34.45 20.48,37.31 21.59,37.31 IC2.27
GPIO17
  Top 0.152: IC2.28 21.59,36.83 20.64,36.83 17.3,33.5 6.99,33.5 GPIO_1.24
GPIO18  (via drill 0.2)
  Top 0.152: v16.35,29.84 22.38,35.88 IC2.29
  Bottom 0.152: v16.35,29.84 5.4,29.84 4.45,30.8 GPIO_1.25
GPIO19  (via drill 0.2)
  Top 0.152: v18.26,30.96 22.86,35.56 22.86,35.88 IC2.30
  Bottom 0.152: v18.26,30.96 6.99,30.96 GPIO_1.26
GPIO20
  Top 0.152: GPIO_1.27 4.45,29.37 14.92,29.37 22.23,36.67 23.02,36.67 23.18,36.51 23.18,36.04 IC2.31
GPIO21
  Top 0.152: IC2.32 23.65,35.88 23.65,35.56 16.51,28.42 6.99,28.42 GPIO_1.28
GPIO22  (via drill 0.2)
  Top 0.152: v24.92,33.66 24.45,34.13 24.45,35.88 IC2.34 | v16.03,24.77 4.45,24.77 GPIO_1.29
  Bottom 0.152: v16.03,24.77 v24.92,33.66
GPIO23  (via drill 0.2)
  Top 0.152: v25.08,35.08 24.92,35.24 24.92,35.88 IC2.35 | v15.88,25.88 6.99,25.88 GPIO_1.30
  Bottom 0.152: v15.88,25.88 v25.08,35.08
GPIO24  (via drill 0.2)
  Top 0.152: v24.29,37.47 25.24,36.51 25.24,36.04 IC2.36
  Bottom 0.152: v24.29,37.47 23.65,37.47 22.54,38.58 19.37,38.58 18.57,39.37 7.46,39.37 7.3,39.53 4.13,39.53 3.33,38.73 3.33,24.45 4.45,23.34 GPIO_1.31
GPIO25  (via drill 0.2)
  Top 0.152: v25.56,36.83 25.56,36.04 IC2.37
  Bottom 0.152: v25.56,36.83 22.23,36.83 20.32,34.92 18.89,34.92 18.57,34.61 18.57,31.27 18.73,31.11 18.73,30.8 11.27,23.34 6.99,23.34 GPIO_1.32 6.99,23.18 5.87,22.07 5.87,17.78 6.51,17.14 6.83,17.14 8.1,15.88 8.1,10.79 14.45,4.45 I2C_SEL.1
GPIO26  (via drill 0.2)
  Top 0.152: v25.88,33.34 25.88,35.08 26.04,35.24 26.04,35.88 IC2.38
  Bottom 0.152: v25.88,33.34 27.62,31.59 27.62,10.48 23.34,6.19 23.34,3.02 I2C_SEL.3 16.51,1.91 5.56,12.86 5.56,18.41 4.45,19.53 GPIO_1.33
GPIO27  (via drill 0.2)
  Top 0.152: v26.35,34.92 26.35,35.88 IC2.39
  Bottom 0.152: v26.35,34.92 25.56,34.92 12.7,22.07 | 12.7,22.07 11.43,20.8 6.99,20.8 GPIO_1.34 | 12.7,22.07 LEDS_1.5
GPIO28  (via drill 0.2)
  Top 0.152: v26.04,31.43 26.83,32.23 26.83,35.88 IC2.40 | v13.18,16.67 5.87,16.67 4.45,18.1 GPIO_1.35
  Bottom 0.152: v26.04,31.43 26.04,20.95 17.46,12.38 | LEDS_1.3 17.46,12.38 | 17.46,12.38 v13.18,16.67
GPIO29  (via drill 0.2)
  Top 0.152: v27.15,31.43 27.3,31.59 27.3,35.88 IC2.41
  Bottom 0.152: v27.15,31.43 27.15,19.53 LEDS_1.1 16.67,9.05 12.38,9.05 11.59,9.84 11.59,12.86 6.99,17.46 GPIO_1.36
N$1
  Top 0.152: R18.1 86.84,11.75 88.58,10 BOOT_2.4 88.74,10 88.74,3.65 BOOT_2.3
N$2
  Top 0.152: R7.2 30.96,6.51 29.37,6.51 29.37,3.81 30,3.17 D9.-
N$3
  Top 0.152: R12.1 45.72,13.49 47.15,13.49 47.15,13.02 D1.-
N$4
  Top 0.152: R14.1 17.62,1.91 17.62,2.86 17.78,3.02 D2.-
N$5
  Top 0.152: R3.1 25.72,63.98 28.26,63.98 28.26,64.61 BOOT_1.3 28.26,64.77 28.26,71.12 BOOT_1.4
N$6
  Top 0.152: R13.1 15.4,1.91 15.4,2.86 15.24,3.02 D3.-
N$7
  Top 0.152: IC2.21 19.84,39.66 R4.2
N$8
  Top 0.152: R15.1 12.54,1.91 12.54,2.86 12.7,3.02 D4.-
N$9
  Top 0.152: LEDS_1.2 D2.+
N$10
  Top 0.152: LEDS_1.4 D3.+
N$11
  Top 0.152: LEDS_1.6 D4.+
N$12
  Top 0.152: Q2.3 61.59,42.07 60.33,42.07 C2.1 60.17,41.91 60.17,40.32 58.42,40.32 58.26,40.48 58.26,41.27 U$1.2
N$13
  Top 0.152: R6.1 53.02,33.81 53.02,35.4 U$1.19
N$14
  Top 0.152: C1.1 65.09,43.66 63.98,43.66 Q2.1 63.82,43.66 63.82,45.09 60.48,45.09 57.63,42.23 57.63,41.43 U$1.3
N$15  (via drill 0.2)
  Top 0.152: v43.5,10.95 37.31,10.95 32.86,6.51 R8.2 | v55.72,33.66 55.72,35.4 U$1.23
  Bottom 0.152: v43.5,10.95 55.72,23.18 v55.72,33.66
N$16
  Top 0.152: 31.91,4.76 31.91,5.08 32.7,5.87 R8.1 | 31.91,4.76 33.5,3.17 D7.- | 31.91,4.76 D8.+
N$17
  Top 0.152: Q1.3 17.53,39.75 C26.1 R4.1
N$18
  Top 0.152: Q1.1 19.1,42.55 C25.1 20,42 20.5,41.5 20.5,40.5 20.94,40.06 IC2.20
N$19  (via drill 0.2)
  Top 0.152: D9.+ 30.16,4.6 31.75,3.02 D8.- 31.91,3.02 32.86,2.06 34.29,2.06 34.29,3.97 | 34.29,3.97 35.24,3.02 D6.- 35.4,3.17 35.72,3.17 37.15,4.6 D5.+ 37.31,4.76 v37.31,5.4 | 34.29,3.97 33.66,4.6 D7.+ | v54.93,34.29 54.93,35.4 U$1.22
  Bottom 0.152: v54.93,34.29 54.93,32.23 45.24,22.54 45.24,13.34 v37.31,5.4
N$20  (via drill 0.2)
  Top 0.152: v39.69,6.51 35.4,6.51 R9.2 | v56.2,32.7 56.2,35.4 U$1.24
  Bottom 0.152: v39.69,6.51 56.2,23.02 v56.2,32.7
N$21
  Top 0.152: 35.4,5.87 35.4,4.76 D6.+ | 35.4,5.87 37.47,5.87 37.94,5.4 37.94,3.81 37.31,3.17 D5.- | 35.4,5.87 R9.1
N$22
  Top 0.152: IC3.21 R19.2
N$24
  Top 0.152: R22.1 79.38,72.39 80.49,72.39 80.49,72.23 D11.-
N$25
  Top 0.152: R21.1 82.07,72.39 83.19,72.39 83.19,72.23 D12.-
N$26
  Top 0.152: R23.1 85.09,72.39 86.2,72.39 86.2,72.23 D13.-
N$27
  Top 0.152: D11.+ 80.64,70.48 80.64,67.15 LEDS_2.2
N$28
  Top 0.152: D12.+ 83.34,70.48 83.34,67.15 LEDS_2.4
N$29
  Top 0.152: D13.+ 86.2,70.48 85.88,70.17 85.88,67.15 LEDS_2.6
N$30
  Top 0.152: R19.1 86.68,33.62 86.9,33.4 | 86.9,33.4 Q3.3 | C44.1 87.26,33.76 86.9,33.4
N$31
  Top 0.152: Q3.1 88.55,31.45 87.75,32.25 86,32.25 85.25,33 C43.1 84,33 83.75,33.25 83.13,33.25 IC3.20
QSPI2_CLK
  Top 0.152: IC3.52 75.32,32.82 72.25,29.75 65.75,29.75 64.25,28.25 64.25,26.25 64.74,25.76 IC5.6 65.72,25.88 66.67,24.92 66.67,4.76 67.63,3.81 SPI_PROG.6
QSPI2_SD0
  Top 0.152: IC3.53 75.42,32.42 72.25,29.25 69.5,29.25 68.75,28.5 68.7,28.45 | 68.7,28.45 67.28,27.03 IC5.5 | SPI_PROG.8 65.25,3.65 66.67,2.22 68.74,2.22 68.74,28.42 68.7,28.45
QSPI2_SD1
  Top 0.152: IC3.55 75.62,31.62 74.5,30.5 74.5,25 73.99,24.49 IC5.2 72.71,24.61 71.75,23.65 71.75,4.76 72.71,3.81 SPI_PROG.2
QSPI2_SD2
  Top 0.152: IC3.54 75.52,32.02 71,27.5 71,26.5 71.74,25.76 IC5.3
QSPI2_SD3
  Top 0.152: IC3.51 75.22,33.22 72.25,30.25 65.25,30.25 63.25,28.25 63.25,26 64.76,24.49 IC5.7
QSPI_CLK
  Top 0.152: IC2.52 29.21,40.46 31.5,42.75 39,42.75 40.5,44.25 40.5,48 39.84,48.66 IC4.6
QSPI_SD0
  Top 0.152: IC2.53 29.11,40.86 35.65,47.4 IC4.5
QSPI_SD1
  Top 0.152: IC2.55 28.91,41.66 30,42.75 30,49.5 30.43,49.94 IC4.2
QSPI_SD2
  Top 0.152: IC2.54 29.01,41.26 33.5,45.75 33.5,48 32.84,48.66 IC4.3
QSPI_SD3
  Top 0.152: IC2.51 29.31,40.06 31.5,42.25 39.5,42.25 41,43.75 41,49.25 40.25,50 38.91,50 IC4.7
RP1USB_N
  Top 0.254: U$1.10 53.08,40.02 53.03,40.02 52.95,39.94 52.95,39.78 51.2,38.04 31.75,38.04 31.65,37.94 R2.2
RP1USB_P
  Top 0.254: U$1.11 52.44,40.02 52.49,40.02 52.57,39.94 51.05,38.42 31.48,38.42 31.4,38.5 R1.2
RP2USB_N
  Top 0.254: U$1.4 56.87,40.02 57.33,39.56 64.29,39.56 68.74,35.12 72.33,35.12 72.47,35.26 R17.2
RP2USB_P
  Top 0.254: U$1.5 56.24,40.02 57.07,39.18 64.14,39.18 68.58,34.73 72.33,34.73 72.39,34.67 R16.2
RP_SCL  (via drill 0.2)
  Top 0.152: U$1.27 58.1,35.4 58.1,31.43 57.47,30.8 IC1.4 57.31,30.64 56.67,30.64 v56.67,29.69
  Bottom 0.152: v56.67,29.69 56.67,22.86 38.26,4.45 I2C_SEL.2
RP_SDA  (via drill 0.2)
  Top 0.152: 59.21,31.59 58.42,30.8 IC1.3 | 59.21,31.59 59.21,36.67 58.74,37.15 57.63,37.15 57.63,35.56 U$1.26 | I2C_SEL.4 25.88,3.02 25.88,7.78 25.72,7.94 R11.2 | 59.21,31.59 60.33,30.48 v60.33,22.38
  Bottom 0.152: v60.33,22.38 39.85,1.91 I2C_SEL.4
SWCLK  (via drill 0.2)
  Top 0.152: v19.53,37.47 20,37.94 20.48,37.94 20.95,38.42 21.59,38.42 IC2.24
  Bottom 0.152: v19.53,37.47 5.4,37.47 4.45,38.42 GPIO_1.19
SWDCLK2  (via drill 0.2)
  Top 0.152: v80.49,31.75 80.49,31.59 81.76,31.59 81.92,31.75 81.92,32.23 81.6,32.54 81.6,34.92 82.23,34.92 82.39,34.77 83.03,34.77 IC3.24
  Bottom 0.152: v80.49,31.75 82.23,33.5 92.08,33.5 93.5,34.92 94.93,34.92 95.89,35.88 GPIO_2.19
SWDIO
  Top 0.152: IC2.25 21.59,38.1 21.11,38.1 20.64,37.62 20.16,37.62 20.16,37.47 18.57,35.88 8.1,35.88 8.1,35.56 7.46,34.92 5.87,34.92 5.87,37.31 6.99,38.42 GPIO_1.20
SWDIO2
  Top 0.152: IC3.25 83.19,35.24 92.08,35.24 92.71,34.61 94.77,34.61 94.77,38.42 93.66,39.53 92.23,39.53 92.23,37.15 93.34,36.04 GPIO_2.20
USB_D2_N
  Top 0.254: U$1.8 54.34,42.53 54.21,42.66 54.21,67.88 54.35,68.02 USB_IN2.2
USB_D2_P
  Top 0.254: U$1.9 53.71,42.53 53.83,42.66 53.83,67.88 53.7,68.02 USB_IN2.3
USB_D3_N
  Top 0.254: U$1.6 55.6,42.53 55.48,42.66 55.48,45.32 70.23,60.07 70.23,67.88 70.35,68 USB_IN1.2
USB_D3_P
  Top 0.254: U$1.7 54.97,42.53 55.1,42.66 55.1,45.48 69.85,60.23 69.85,67.88 69.7,68.03 USB_IN1.3
USB_N
  Top 0.254: USB_IN.2 55.95,7.46 56.08,7.59 56.08,24.05 50.67,29.46 50.67,34.42 50.55,34.54 U$1.15
USB_P
  Top 0.254: USB_IN.3 56.6,7.46 56.47,7.59 56.47,24.21 51.05,29.62 51.05,34.42 51.18,34.54 U$1.16
USBD2_N
  Top 0.254: IC3.46 75.27,35.22 75.26,35.21 73.6,35.21 73.55,35.26 R17.1
USBD2_P
  Top 0.254: IC3.47 75.27,34.82 75.26,34.83 73.6,34.83 73.43,34.67 R16.1
USBD_N
  Top 0.254: IC2.46 29.43,38.06 29.44,38.07 30.48,38.07 30.61,37.94 R2.1
USBD_P
  Top 0.254: IC2.47 29.43,38.46 29.44,38.45 30.77,38.45 R1.1
VBUS  (via drill 0.35)
  Top 0.152: POWER.6 41.91,3.02 v41.91,1.96 | v62.23,13.34 TP_VBUS.1
  Top 0.406: 43.16,3.15 44.4,4.4 49.2,4.4 53,8.2 54.6,8.2 55.3,7.5 USB_IN.1 55.3,2.7 53.93,1.33 49.11,1.33 POWER.1 43.16,3.15 | 43.16,3.15 POWER.6
  Bottom 0.152: v41.91,1.96 42.77,1.09 61.42,1.09 62.23,1.91 v62.23,13.34

## Text on the board
tNames: Gnd | 3v3 | 3v3 | Gnd | Gnd | 0 | 1 | Gnd | 29 | 2 | 3 | 28 | 27 | 4 | 5 | 26 | 6 | 7 | 25 | 24 | 23 | 8 | 9 | 22 | 10 | 11 | 21 | 20 | 19 | 12 | 13 | 18 | 14 | 15 | 17 | 16 | !RST! | Clk | IO | Gnd | Gnd | !RST! | IO | Clk | 15 | 16 | 17 | 14 | 13 | 18 | 19 | 12 | 11 | 20 | 21 | 10 | 9 | 22 | 23 | 8 | 24 | 25 | 7 | 6 | 5 | 26 | 27 | 4 | 28 | 29 | 3 | 2 | 1 | Gnd | Gnd | 0 | Gnd | Gnd | 3v3 | 3v3 | 25 | SCL | 26 | SDA | TX | CK | !CS! | RX